# EAGLE design Motores+Bluetoothv4 (EAGLE 7.1.0)
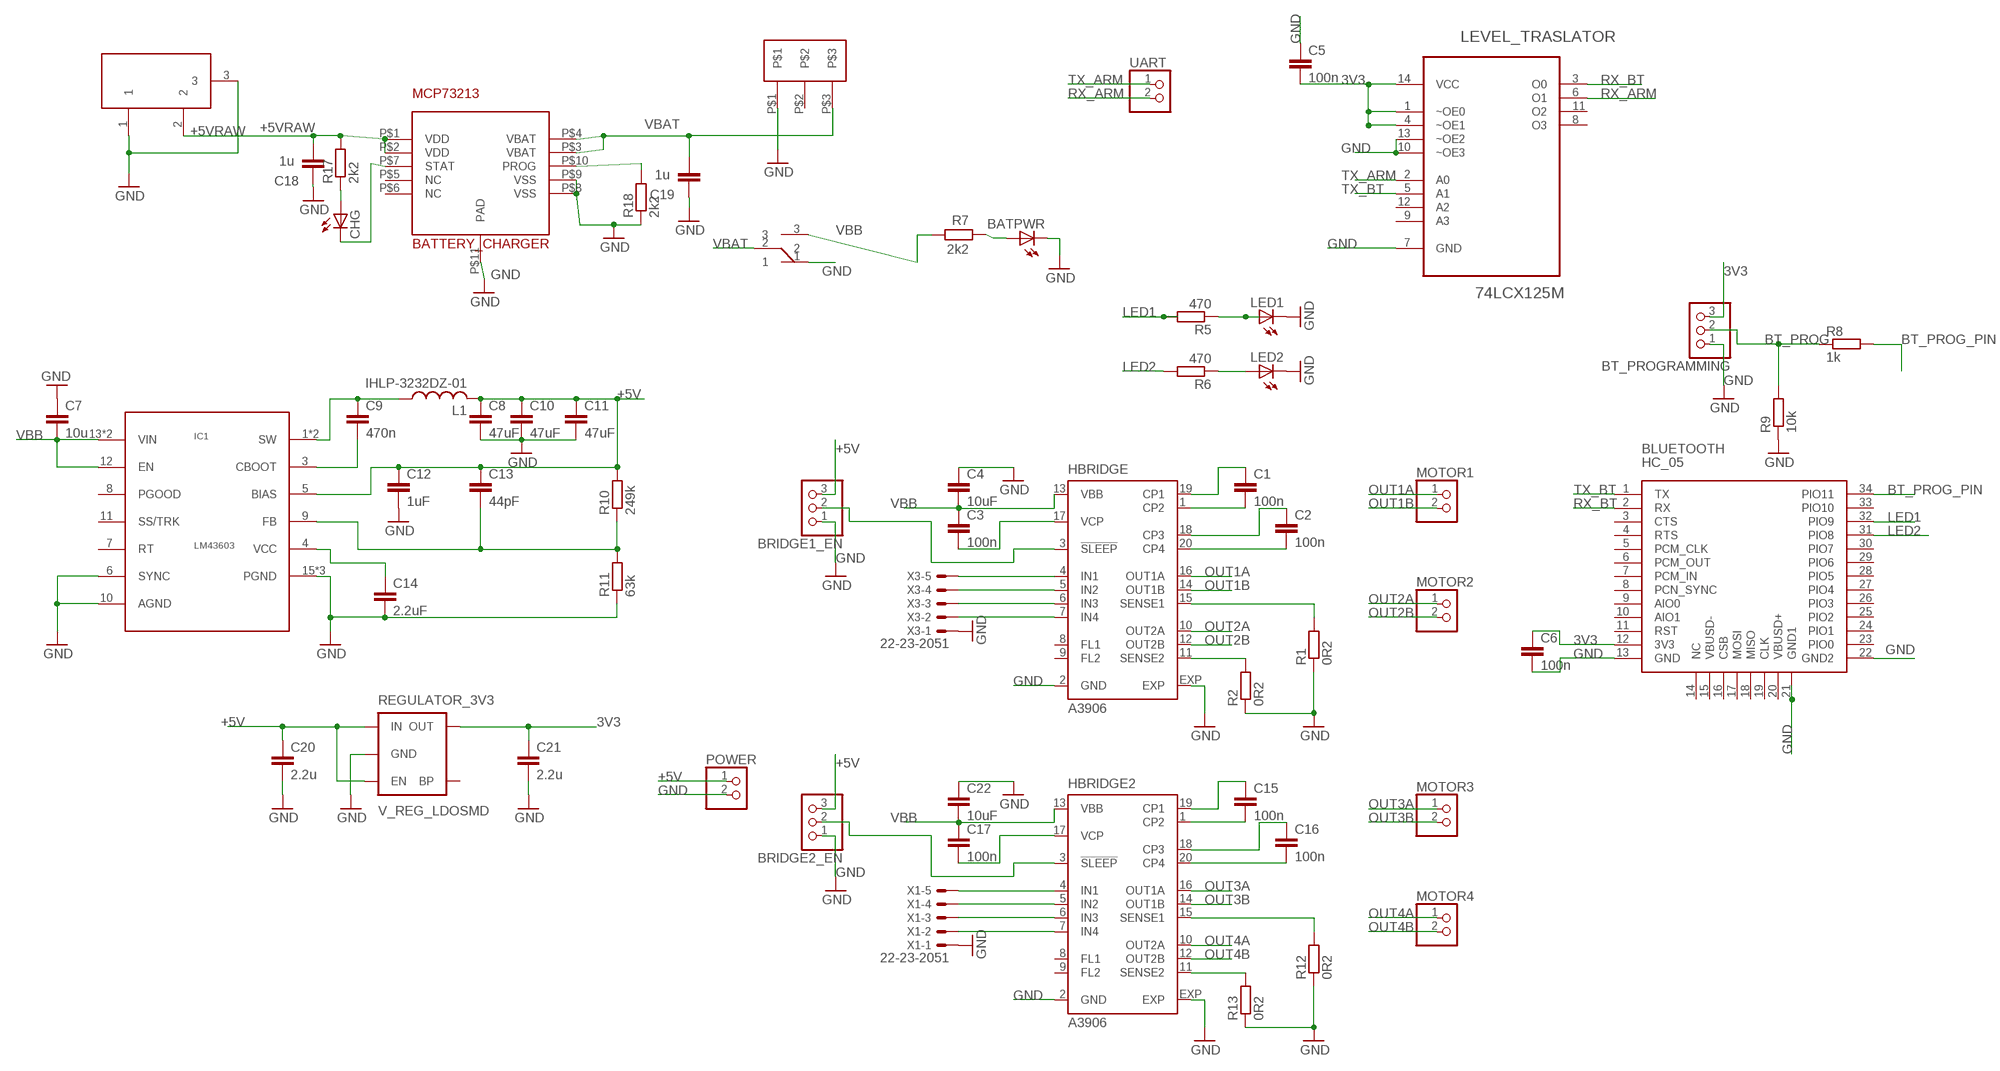
[diagram p0: schematic, sheet 1]

## Parts
BATPWR  LEDCHIPLED_0603  [CHIPLED_0603]
BATTERY_CHARGER  MCP73213  [DFN103X3]
BLUETOOTH  HC_05  [BLUETOOTH_SMD]
BRIDGE1_EN  PINHD-1X3ROUND  [1X03ROUND]
BRIDGE2_EN  PINHD-1X3ROUND  [1X03ROUND]
BT_PROGRAMMING  PINHD-1X3ROUND  [1X03ROUND]
C1  100n  C-EUC0603  [C0603]
C2  100n  C-EUC0603  [C0603]
C3  100n  C-EUC0603  [C0603]
C4  10uF  C-EUC0805  [C0805]
C5  100n  C-EUC0603  [C0603]
C6  100n  C-EUC0603  [C0603]
C7  10u  C-EUC1206  [C1206]
C8  47uF  C-EUC1210  [C1210]
C9  470n  C-EUC0603  [C0603]
C10  47uF  C-EUC1210  [C1210]
C11  47uF  C-EUC1210  [C1210]
C12  1uF  C-EUC0805  [C0805]
C13  44pF  C-EUC0603  [C0603]
C14  2.2uF  C-EUC0805  [C0805]
C15  100n  C-EUC0603  [C0603]
C16  100n  C-EUC0603  [C0603]
C17  100n  C-EUC0603  [C0603]
C18  1u  C-EUC0603  [C0603]
C19  1u  C-EUC0603  [C0603]
C20  2.2u  C-EUC0603K  [C0603K]
C21  2.2u  C-EUC0603K  [C0603K]
C22  10uF  C-EUC0805  [C0805]
CHG  LEDCHIPLED_0603  [CHIPLED_0603]
HBRIDGE  A3906  [QFN20]
HBRIDGE2  A3906  [QFN20]
IC1  LM43603  [PW_R-PDSO-G16]
L1  IHLP-3232DZ-01  [IHLP-3232DZ-01]
LED1  LEDCHIP-LED0603  [CHIP-LED0603]
LED2  LEDCHIP-LED0603  [CHIP-LED0603]
LEVEL_TRASLATOR  74LCX125M  [SOIC127P600X175-14N]
MOTOR1  PINHD-1X2ROUND  [1X02ROUND]
MOTOR2  PINHD-1X2ROUND  [1X02ROUND]
MOTOR3  PINHD-1X2ROUND  [1X02ROUND]
MOTOR4  PINHD-1X2ROUND  [1X02ROUND]
POWER  PINHD-1X2ROUND  [1X02ROUND]
R1  0R2  R-EU_R0805  [R0805]
R2  0R2  R-EU_R0805  [R0805]
R5  470  R-EU_R0603  [R0603]
R6  470  R-EU_R0603  [R0603]
R7  2k2  R-EU_R0603  [R0603]
R8  1k  R-EU_R0603  [R0603]
R9  10k  R-EU_R0603  [R0603]
R10  249k  R-EU_R0603  [R0603]
R11  63k  R-EU_R0603  [R0603]
R12  0R2  R-EU_R0805  [R0805]
R13  0R2  R-EU_R0805  [R0805]
R17  2k2  R-EU_R0603  [R0603]
R18  2k2  R-EU_R0603  [R0603]
REGULATOR_3V3  V_REG_LDOSMD  [SOT23-5]
U$1  100SP1T1B4M2QE  [100SP1T1B4M2QE]
U$3  JST-XHA-3  [JST-XHA-3]
UART  PINHD-1X2ROUND  [1X02ROUND]
X1  22-23-2051  [22-23-2051]
X2  DC21MMX  [DC-21MM]
X3  22-23-2051  [22-23-2051]

## Nets
3V3: BLUETOOTH.12(3V3) BT_PROGRAMMING.3 C5.2 C6.1 C21.1 LEVEL_TRASLATOR.1(~OE0) LEVEL_TRASLATOR.4(~OE1) LEVEL_TRASLATOR.14(VCC) REGULATOR_3V3.5(OUT)
+5V: BRIDGE1_EN.3 BRIDGE2_EN.3 C8.1 C10.1 C11.1 C12.1 C13.1 C20.1 IC1.5(BIAS) L1.P$2 POWER.1 R10.2 REGULATOR_3V3.1(IN) REGULATOR_3V3.3(EN)
+5VRAW: BATTERY_CHARGER.P$1(VDD) BATTERY_CHARGER.P$2(VDD) C18.1 R17.2 X2.2
BT_PROG: BT_PROGRAMMING.2 R8.1 R9.2
BT_PROG_PIN: BLUETOOTH.34(PIO11) R8.2
GND: BATPWR.C BATTERY_CHARGER.P$8(VSS) BATTERY_CHARGER.P$9(VSS) BATTERY_CHARGER.P$11(PAD) BLUETOOTH.13(GND) BLUETOOTH.21(GND1) BLUETOOTH.22(GND2) BRIDGE1_EN.1 BRIDGE2_EN.1 BT_PROGRAMMING.1 C4.1 C5.1 C6.2 C7.1 C8.2 C10.2 C11.2 C12.2 C14.2 C18.2 C19.2 C20.2 C21.2 C22.1 HBRIDGE2.2(GND) HBRIDGE2.EXP HBRIDGE.2(GND) HBRIDGE.EXP IC1.6(SYNC) IC1.10(AGND) IC1.15(PGND) IC1.16(PGND) IC1.TP(PGND) LED1.C LED2.C LEVEL_TRASLATOR.7(GND) LEVEL_TRASLATOR.10(~OE3) LEVEL_TRASLATOR.13(~OE2) POWER.2 R1.1 R2.1 R9.1 R11.1 R12.1 R13.1 R18.1 REGULATOR_3V3.2(GND) U$1.1 U$3.P$1 X1.1 X2.1 X2.3 X3.1
LED1: BLUETOOTH.32(PIO9) R5.2
LED2: BLUETOOTH.31(PIO8) R6.2
N$1: C1.1 HBRIDGE.19(CP1)
N$2: C1.2 HBRIDGE.1(CP2)
N$3: C2.1 HBRIDGE.18(CP3)
N$4: C2.2 HBRIDGE.20(CP4)
N$5: C3.2 HBRIDGE.17(VCP)
N$6: LED2.A R6.1
N$7: HBRIDGE.15(SENSE1) R1.2
N$8: HBRIDGE.11(SENSE2) R2.2
N$9: HBRIDGE.4(IN1) X3.5
N$10: HBRIDGE.5(IN2) X3.4
N$11: HBRIDGE.6(IN3) X3.3
N$12: HBRIDGE.7(IN4) X3.2
N$13: BRIDGE1_EN.2 HBRIDGE.3(!SLEEP)
N$14: LED1.A R5.1
N$15: BATPWR.A R7.2
N$16: C9.2 IC1.3(CBOOT)
N$17: C9.1 IC1.1(SW) IC1.2(SW) L1.P$1
N$18: C14.1 IC1.4(VCC)
N$19: C13.2 IC1.9(FB) R10.1 R11.2
N$20: C15.1 HBRIDGE2.19(CP1)
N$21: C15.2 HBRIDGE2.1(CP2)
N$22: C16.1 HBRIDGE2.18(CP3)
N$23: C16.2 HBRIDGE2.20(CP4)
N$24: C17.2 HBRIDGE2.17(VCP)
N$25: HBRIDGE2.15(SENSE1) R12.2
N$26: HBRIDGE2.11(SENSE2) R13.2
N$27: HBRIDGE2.4(IN1) X1.5
N$28: HBRIDGE2.5(IN2) X1.4
N$29: HBRIDGE2.6(IN3) X1.3
N$30: HBRIDGE2.7(IN4) X1.2
N$31: BRIDGE2_EN.2 HBRIDGE2.3(!SLEEP)
N$43: CHG.A R17.1
N$44: BATTERY_CHARGER.P$7(STAT) CHG.C
N$45: BATTERY_CHARGER.P$10(PROG) R18.2
OUT1A: HBRIDGE.16(OUT1A) MOTOR1.1
OUT1B: HBRIDGE.14(OUT1B) MOTOR1.2
OUT2A: HBRIDGE.10(OUT2A) MOTOR2.1
OUT2B: HBRIDGE.12(OUT2B) MOTOR2.2
OUT3A: HBRIDGE2.16(OUT1A) MOTOR3.1
OUT3B: HBRIDGE2.14(OUT1B) MOTOR3.2
OUT4A: HBRIDGE2.10(OUT2A) MOTOR4.1
OUT4B: HBRIDGE2.12(OUT2B) MOTOR4.2
RX_ARM: LEVEL_TRASLATOR.6(O1) UART.2
RX_BT: BLUETOOTH.2(RX) LEVEL_TRASLATOR.3(O0)
TX_ARM: LEVEL_TRASLATOR.2(A0) UART.1
TX_BT: BLUETOOTH.1(TX) LEVEL_TRASLATOR.5(A1)
VBAT: BATTERY_CHARGER.P$3(VBAT) BATTERY_CHARGER.P$4(VBAT) C19.1 U$1.2 U$3.P$3
VBB: C3.1 C4.2 C7.2 C17.1 C22.2 HBRIDGE2.13(VBB) HBRIDGE.13(VBB) IC1.12(EN) IC1.13(VIN) IC1.14(VIN) R7.1 U$1.3
Unconnected: BATTERY_CHARGER.P$5(NC) BATTERY_CHARGER.P$6(NC) BLUETOOTH.3(CTS) BLUETOOTH.4(RTS) BLUETOOTH.5(PCM_CLK) BLUETOOTH.6(PCM_OUT) BLUETOOTH.7(PCM_IN) BLUETOOTH.8(PCN_SYNC) BLUETOOTH.9(AIO0) BLUETOOTH.10(AIO1) BLUETOOTH.11(RST) BLUETOOTH.14(NC) BLUETOOTH.15(VBUSD-) BLUETOOTH.16(CSB) BLUETOOTH.17(MOSI) BLUETOOTH.18(MISO) BLUETOOTH.19(CLK) BLUETOOTH.20(VBUSD+) BLUETOOTH.23(PIO0) BLUETOOTH.24(PIO1) BLUETOOTH.25(PIO2) BLUETOOTH.26(PIO3) BLUETOOTH.27(PIO4) BLUETOOTH.28(PIO5) BLUETOOTH.29(PIO6) BLUETOOTH.30(PIO7) BLUETOOTH.33(PIO10) HBRIDGE2.8(FL1) HBRIDGE2.9(FL2) HBRIDGE.8(FL1) HBRIDGE.9(FL2) IC1.7(RT) IC1.8(PGOOD) IC1.11(SS/TRK) LEVEL_TRASLATOR.8(O3) LEVEL_TRASLATOR.9(A3) LEVEL_TRASLATOR.11(O2) LEVEL_TRASLATOR.12(A2) REGULATOR_3V3.4(BP) U$3.P$2

## Library data of the parts
BATPWR CHG LED1 LED2 = led:LED: LED OSRAM: - CHIPLED LG R971, LG N971, LY N971, LG Q971, LY Q971, LO R971, LY R971 LH N974, LH R974 LS Q976, LO Q976, LY Q976 LO Q996 - Hyper CHIPLED LW Q18S LB Q993, LB Q99A, LB R99A - SideLED LS A670, LO A670, LY A670, LG A670, LP A670 LB A673, LV A673, LT A673, LW A673 LH A674 LY A675 LS A676, LA A676, LO A676, LY A676, LW A676 LS A679, LY A679, LG A679 - Hyper Micro SIDELED® LS Y876, LA Y876, LO Y876, LY Y876 LT Y87S - SmartLED LW L88C, LW L88S LB L89C, LB L89S, LG L890 LS L89K, LO L89K, LY L89K LS L896, LA L896, LO L896, LY L896 - TOPLED LS T670, LO T670, LY T670, LG T670, LP T670 LSG T670, LSP T670, LSY T670, LOP T670, LYG T670 LG T671, LOG T671, LSG T671 LB T673, LV T673, LT T673, LW T673 LH T674 LS T676, LA T676, LO T676, LY T676, LB T676, LH T676, LSB T676, LW T676 LB T67C, LV T67C, LT T67C, LS T67K, LO T67K, LY T67K, LW E67C LS E67B, LA E67B, LO E67B, LY E67B, LB E67C, LV E67C, LT E67C LW T67C LS T679, LY T679, LG T679 LS T770, LO T770, LY T770, LG T770, LP T770 LB T773, LV T773, LT T773, LW T773 LH T774 LS E675, LA E675, LY E675, LS T675 LS T776, LA T776, LO T776, LY T776, LB T776 LHGB T686 LT T68C, LB T68C - Hyper Mini TOPLED® LB M676 - Mini TOPLED Santana® LG M470 LS M47K, LO M47K, LY M47K Source: http://www.osram.convergy.de LUXEON: - LUMILED® LXK2-PW12-R00, LXK2-PW12-S00, LXK2-PW14-U00, LXK2-PW14-V00 LXK2-PM12-R00, LXK2-PM12-S00, LXK2-PM14-U00 LXK2-PE12-Q00, LXK2-PE12-R00, LXK2-PE12-S00, LXK2-PE14-T00, LXK2-PE14-U00 LXK2-PB12-K00, LXK2-PB12-L00, LXK2-PB12-M00, LXK2-PB14-N00, LXK2-PB14-P00, LXK2-PB14-Q00 LXK2-PR12-L00, LXK2-PR12-M00, LXK2-PR14-Q00, LXK2-PR14-R00 LXK2-PD12-Q00, LXK2-PD12-R00, LXK2-PD12-S00 LXK2-PH12-R00, LXK2-PH12-S00 LXK2-PL12-P00, LXK2-PL12-Q00, LXK2-PL12-R00 Source: www.luxeon.com KINGBRIGHT: KA-3528ASYC Source: www.kingbright.com
BATTERY_CHARGER = TEORA:MCP73213
BLUETOOTH = Bluetooth%20HC-05:HC_05: HC-05 Bluetooth Module
BRIDGE1_EN BRIDGE2_EN BT_PROGRAMMING = pinhead:PINHD-1X3: PIN HEADER
C1-C22 = rcl:C-EU: CAPACITOR, European symbol
HBRIDGE HBRIDGE2 = allegro:A3906: Low Voltage Stepper and Single/Dual DC Motor Driver Data Sheet <http://www.allegromicro.com/en/Products/Part_Numbers/3906/3906.pdf>
IC1 = texas2:LM43603
L1 = ArmDuino:IHLP-3232DZ-01
LEVEL_TRASLATOR = 74LCX125:74LCX125M: Low Voltage Quad Buffer with 5V Tolerant Inputs and Outputs; MPN: 74LCX125M; OC_FARNELL: 1013776; OC_NEWARK: 78K6286; PACKAGE: SOIC-14; SUPPLIER: Fairchild
MOTOR1-MOTOR4 POWER UART = pinhead:PINHD-1X2: PIN HEADER
R1 R2 R5-R13 R17 R18 = rcl:R-EU_: RESISTOR, European symbol
REGULATOR_3V3 = SparkFun:V_REG_LDO: Voltage Regulator LDO Standard 150mA LDO voltage regulator in SOT-23 layout. Micrel part MIC5205. BP (by-pass) pin is used to lower output noise with 470pF cap.
U$1 = switch:100SP1T1B4M2QE
U$3 = TEORA:JST-XHA-3
X1 X3 = con-molex:22-23-2051: .100" (2.54mm) Center Header - 5 Pin; MF: MOLEX; MPN: 22-23-2051; OC_FARNELL: 1462952; OC_NEWARK: 38C9178
X2 = powersupply:DC21MM

## Board
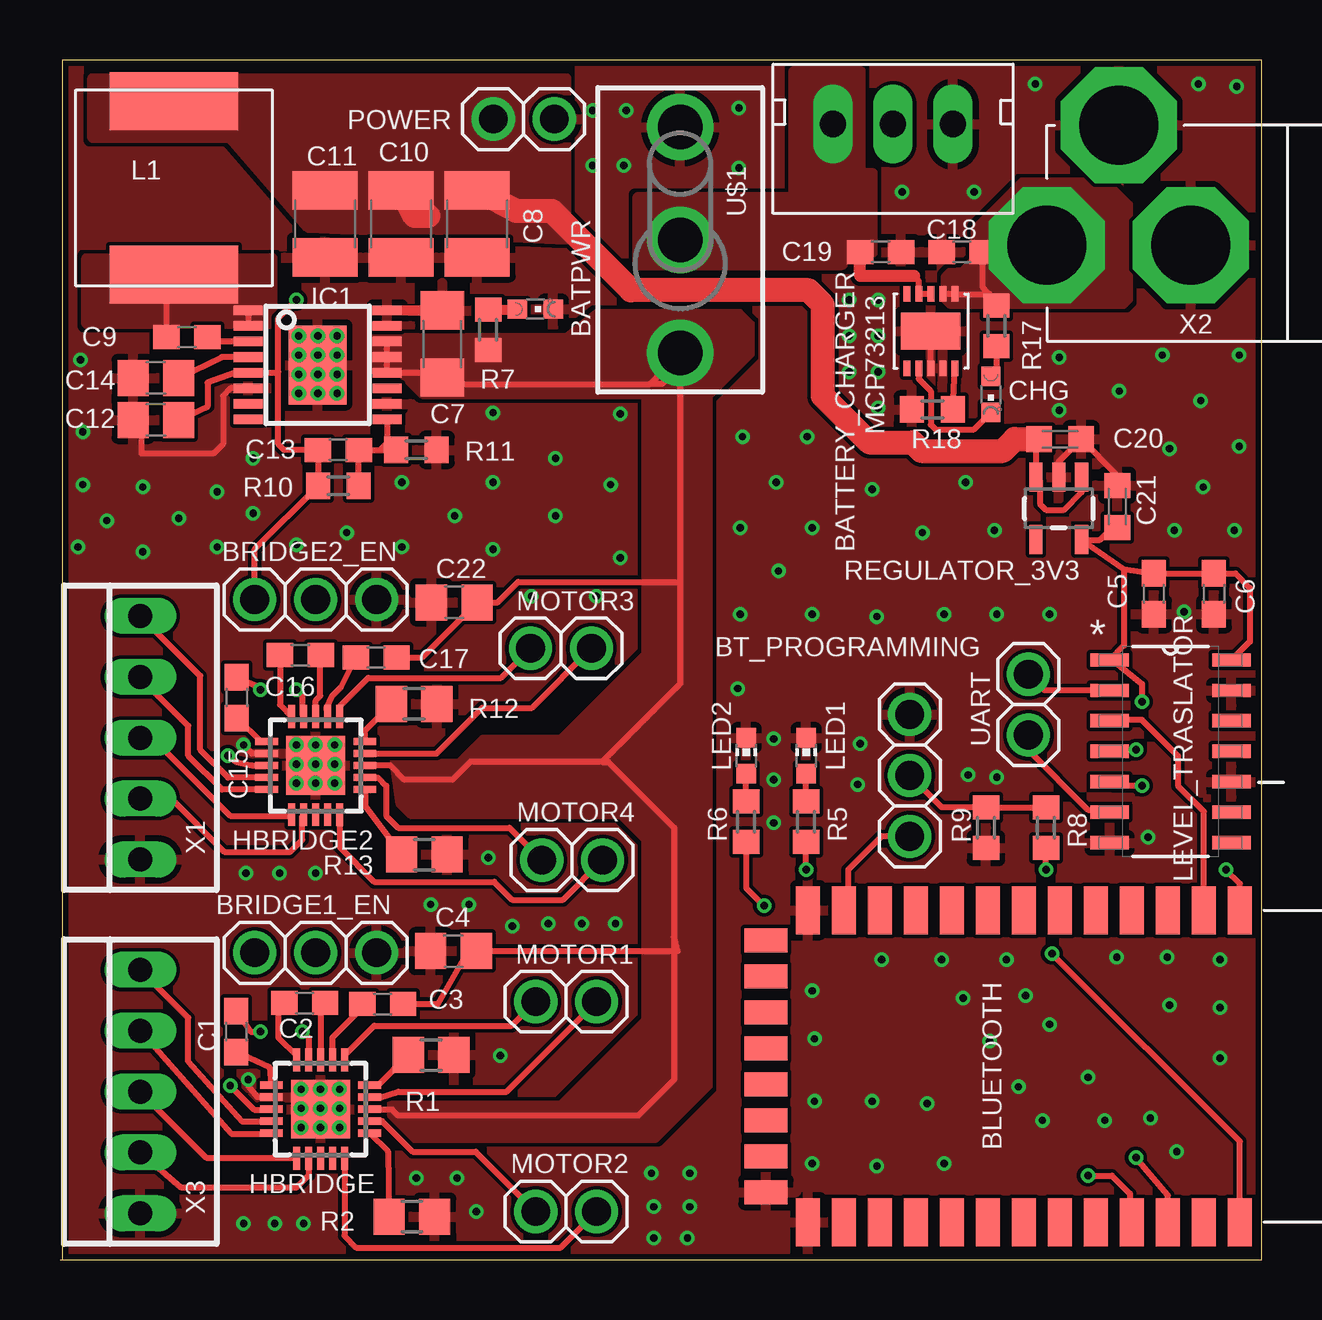
[diagram p1: board, top side]
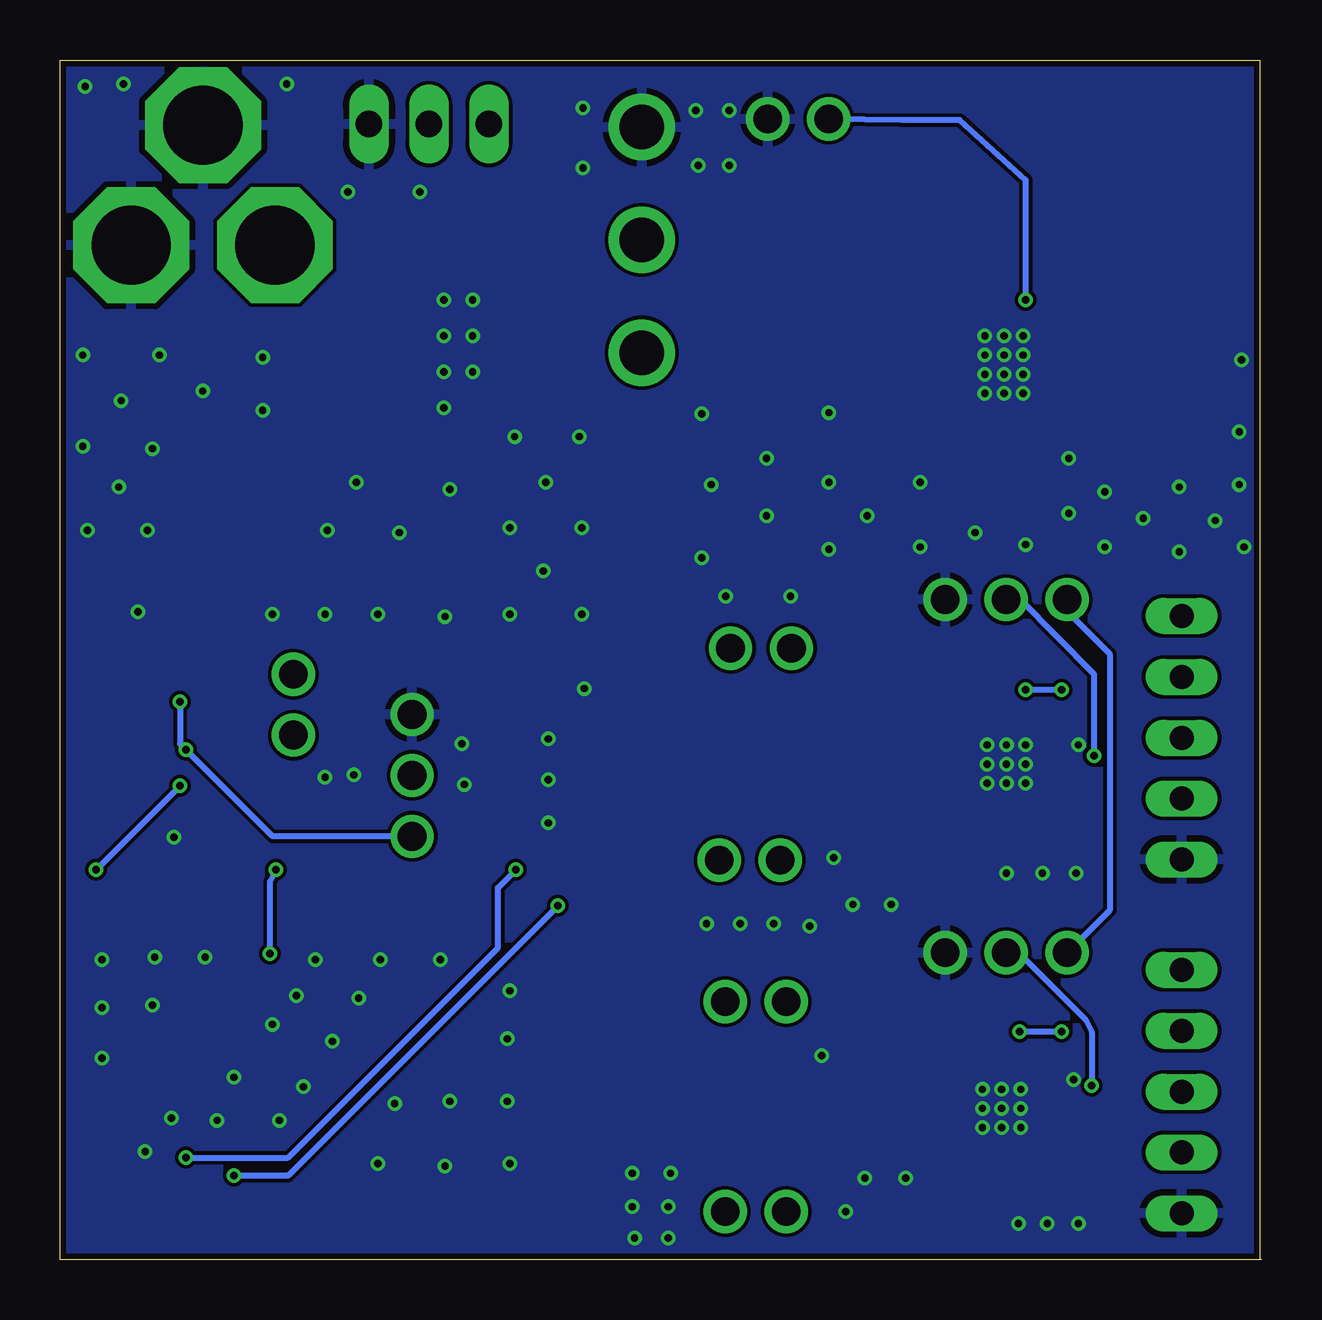
[diagram p2: board, bottom side, seen from below]

Size 50.1 x 50 mm. Coordinates in mm from the lower left corner, seen from the top.
Outline: 0.1,0 0.1,50 50.1,50 50.1,0 0.1,0
Outline: 0,0 0.1,0
Copper layers (1*16): Top 0.035mm / dielectric 1.5mm / Bottom 0.035mm
Design rules "Elecrow_2-layer_eagle_rule *": minimum track width 6mil, minimum drill 3mil, track to track 6mil, track to pad 6mil, pad to pad 6mil, via to via 6mil, smd to smd 0mil, copper to edge 10mil, drill to drill 10mil, minimum pad ring 10mil, minimum via ring 6mil, stop-mask expansion 2mil, vias tented up to drill 100mil, thermal gap 10mil

### Footprints (pad centres in the part's own frame; a part is rotated, then mirrored left to right if it is on the bottom)
CHIPLED_0603 = smd 0.8 x 0.8: A 0,-0.75; C 0,0.75
DFN103X3 = smd 0.65 x 0.3: P$1 -1.55,1; P$2 -1.55,0.5; P$3 -1.55,0; P$4 -1.55,-0.5; P$5 -1.55,-1; P$6 1.55,-1; P$7 1.55,-0.5; P$8 1.55,0; P$9 1.55,0.5; P$10 1.55,1 | smd 1.55 x 2.48: P$11 0,0
BLUETOOTH_SMD = smd 2 x 1: 1 -6.35,3.81; 2 -6.35,2.31; 3 -6.35,0.81; 4 -6.35,-0.69; 5 -6.35,-2.19; 6 -6.35,-3.69; 7 -6.35,-5.19; 8 -6.35,-6.69; 9 -6.35,-8.19; 10 -6.35,-9.69; 11 -6.35,-11.19; 12 -6.35,-12.69; 13 -6.35,-14.19; 22 6.65,-14.19; 23 6.65,-12.69; 24 6.65,-11.19; 25 6.65,-9.69; 26 6.65,-8.19; 27 6.65,-6.69; 28 6.65,-5.19; 29 6.65,-3.69; 30 6.65,-2.19; 31 6.65,-0.69; 32 6.65,0.81; 33 6.65,2.31; 34 6.65,3.81 | smd 1 x 1.8: 14 -5.1,-15.94; 15 -3.6,-15.94; 16 -2.1,-15.94; 17 -0.6,-15.94; 18 0.9,-15.94; 19 2.4,-15.94; 20 3.9,-15.94; 21 5.4,-15.94
1X03ROUND = drill 1.2: 1 -2.54,0; 2 0,0; 3 2.54,0
C0603 = smd 1.1 x 1: 1 -0.85,0; 2 0.85,0
C0805 = smd 1.3 x 1.5: 1 -0.95,0; 2 0.95,0
C1206 = smd 1.6 x 1.8: 1 -1.4,0; 2 1.4,0
C1210 = smd 1.6 x 2.7: 1 -1.4,0; 2 1.4,0
C0603K = smd 1.05 x 1.08: 1 -0.875,0; 2 0.875,0
QFN20 = smd 0.95 x 0.3: 1 -2.05,1; 2 -2.05,0.5; 3 -2.05,0; 4 -2.05,-0.5; 5 -2.05,-1; 11 2.05,-1; 12 2.05,-0.5; 13 2.05,0; 14 2.05,0.5; 15 2.05,1 | smd 0.3 x 0.95: 6 -1,-2.05; 7 -0.5,-2.05; 8 0,-2.05; 9 0.5,-2.05; 10 1,-2.05; 16 1,2.05; 17 0.5,2.05; 18 0,2.05; 19 -0.5,2.05; 20 -1,2.05 | smd 2.45 x 2.45: EXP 0,0
PW_R-PDSO-G16 = smd 0.4 x 1.2: 1 -2.275,-2.9; 2 -1.625,-2.9; 3 -0.975,-2.9; 4 -0.325,-2.9; 5 0.325,-2.9; 6 0.975,-2.9; 7 1.625,-2.9; 8 2.275,-2.9; 9 2.275,2.9; 10 1.625,2.9; 11 0.975,2.9; 12 0.325,2.9; 13 -0.325,2.9; 14 -0.975,2.9; 15 -1.625,2.9; 16 -2.275,2.9 | smd 3.29 x 2.41: TP 0,0
IHLP-3232DZ-01 = smd 2.413 x 5.334: P$1 3.619,0; P$2 -3.619,0
CHIP-LED0603 = smd 0.8 x 0.8: A 0,-0.75; C 0,0.75
SOIC127P600X175-14N = smd 1.6 x 0.559: 1 -2.54,3.81; 2 -2.54,2.54; 3 -2.54,1.27; 4 -2.54,0; 5 -2.54,-1.27; 6 -2.54,-2.54; 7 -2.54,-3.81; 8 2.54,-3.81; 9 2.54,-2.54; 10 2.54,-1.27; 11 2.54,0; 12 2.54,1.27; 13 2.54,2.54; 14 2.54,3.81
1X02ROUND = drill 1.2: 1 -1.27,0; 2 1.27,0
R0805 = smd 1.3 x 1.5: 1 -0.95,0; 2 0.95,0
R0603 = smd 1 x 1.1: 1 -0.85,0; 2 0.85,0
SOT23-5 = smd 0.55 x 1.2: 1 -0.95,-1.3; 2 0,-1.3; 3 0.95,-1.3; 4 0.95,1.3; 5 -0.95,1.3
100SP1T1B4M2QE = drill 1.85: 1 -4.7,0; 2 0,0; 3 4.7,0
JST-XHA-3 = drill 1.1 long: P$1 -2.5,0; P$2 0,0; P$3 2.5,0
22-23-2051 = drill 1 long: 1 -5.08,0; 2 -2.54,0; 3 0,0; 4 2.54,0; 5 5.08,0
DC-21MM = drill 3.302 pad 4.826 octagon: 1 -5.08,-3.353; 2 -0.076,-6.35; 3 -0.076,-0.356

### Placement (x,y rotation side)
BATPWR  19.81,39.61 270 top
BATTERY_CHARGER  36.3,38.7 270 top
BLUETOOTH  45.37,8.21 270 top
BRIDGE1_EN  10.66,12.79 180 top
BRIDGE2_EN  10.66,27.51 180 top
BT_PROGRAMMING  35.42,20.18 270 top
C1  7.35,9.5 270 top
C2  10.2,10.69 180 top
C3  13.45,10.65 180 top
C4  16.4,12.86 0 top
C5  45.6,27.75 90 top
C6  48.1,27.75 270 top
C7  15.94,38.16 270 top
C8  17.39,43.17 270 top
C9  5.29,38.44 0 top
C10  14.22,43.17 270 top
C11  11.05,43.17 270 top
C12  4,35 180 top
C13  11.6,33.75 0 top
C14  4,36.75 180 top
C15  7.37,23.42 270 top
C16  10.02,25.19 180 top
C17  13.18,25.1 180 top
C18  37.6,42 180 top
C19  34.21,41.99 0 top
C20  41.69,34.19 0 top
C21  44.07,31.39 90 top
C22  16.43,27.39 0 top
CHG  38.8,36.06 180 top
HBRIDGE  10.86,6.27 0 top
HBRIDGE2  10.66,20.59 0 top
IC1  10.74,37.29 270 top
L1  4.75,44.67 270 top
LED1  31.1,21 0 top
LED2  28.6,21 0 top
LEVEL_TRASLATOR  46.29,21.18 0 top
MOTOR1  21.1,10.75 0 top
MOTOR2  21.1,2 180 top
MOTOR3  20.88,25.48 0 top
MOTOR4  21.35,16.65 180 top
POWER  19.33,47.54 0 top
R1  15.47,8.53 180 top
R2  14.67,1.79 180 top
R3  [R0603]  65.77,37.76 0 top  (outside the outline)
R4  NM  [R0603]  60.77,35.95 0 top  (outside the outline)
R5  31.1,18.25 270 top
R6  28.6,18.25 270 top
R7  17.85,38.75 90 top
R8  41.1,18 270 top
R9  38.6,18 90 top
R10  11.6,32.25 180 top
R11  14.85,33.75 180 top
R12  14.76,23.16 180 top
R13  15.19,16.88 180 top
R17  39.03,38.92 90 top
R18  36.36,35.43 0 top
REGULATOR_3V3  41.63,31.31 180 top
U$1  25.85,42.5 270 top
U$3  34.72,47.33 180 top
UART  40.37,23.13 270 top
X1  3.35,21.75 90 top
X2  47.49,42.2 270 top
X3  3.35,7 90 top

### Tracks (layer width: path | path; a pad name or v marks a point on that pad's centre or on a via)
3V3  (via drill 0.3)
  Top 0.25: C21.1 43.87,30.52 43.35,30 REGULATOR_3V3.5 44.35,28.78 | 44.35,28.78 C5.2 C6.1 49,28.6 49.6,28 49.6,25.76 LEVEL_TRASLATOR.14 | 44.35,28.78 44.35,25.59 LEVEL_TRASLATOR.1 43.86,24.99 45.1,24 v45.1,23.25 | v44.85,21.25 43.82,21.25 LEVEL_TRASLATOR.4 | BT_PROGRAMMING.3 34.24,17.64 32.85,16.25 32.85,14.73 BLUETOOTH.12
  Bottom 0.25: v45.1,23.25 45.1,21.5 v44.85,21.25 41.24,17.64 BT_PROGRAMMING.3
+5V  (via drill 0.3)
  Top 0.25: C20.1 40.68,34.05 REGULATOR_3V3.3 40.85,32.44 40.85,31.5 41.1,31.25 41.85,31.25 42.58,31.98 REGULATOR_3V3.1 | C12.1 6.15,35.55 6.15,36.55 7.31,36.97 IC1.5 9.06,36.97 9.1,37 | 9.1,37 9.1,34 9.35,33.75 C13.1 R10.2 8.12,29.62 BRIDGE2_EN.3 | 9.1,37 9.1,39.25 v9.85,40
  Top 1: C8.1 19.02,43.7 20.5,43.7 23.8,40.4 31.2,40.4 31.8,39.8 31.8,36 33.75,34.05 35.55,34.05 35.9,33.7 39.3,33.7 39.8,34.2 40.8,34.2 C20.1 | C10.1 15.28,43.57 15.35,43.5 14.79,43.5 C10.1
  Bottom 0.25: v9.85,40 9.85,45 12.6,47.5 15.02,47.5 POWER.1 | BRIDGE2_EN.3 8.12,27.02 6.35,25.25 6.35,14.56 BRIDGE1_EN.3
  pour Top (rank 2, no thermals): 21.1,42.5 10.35,43 7.1,46.75 1.35,46.75 1.35,49.25 21.1,49.25
+5VRAW
  Top 0.25: BATTERY_CHARGER.P$2 BATTERY_CHARGER.P$1 38.75,40.25 R17.2 38.45,40.55 C18.1 41.6,42 41.85,42.25 41.6,42.25 41.63,42.28 X2.2
  pour Top (no thermals): 44.35,39.75 37.1,39.75 36.85,40 36.85,41 37.1,41.25 37.6,41.25 38.1,41.75 38.1,43 40.1,45 43.6,45 44.6,44 44.6,40
BT_PROG
  Top 0.25: BT_PROGRAMMING.2 36.75,18.85 R9.2 R8.1
BT_PROG_PIN  (via drill 0.3)
  Top 0.25: BLUETOOTH.34 49.18,4.92 v41.35,12.75 | v41.1,16.25 R8.2
  Bottom 0.25: v41.35,12.75 41.35,15.75 v41.1,16.25
GND  (via drill 0.3)
  Top 0.25: C21.2 44.07,32.69 C20.2 41.63,33.26 REGULATOR_3V3.2 | HBRIDGE.2 8.23,6.77 7.85,7.25 v7.85,7.5 | BATTERY_CHARGER.P$8 BATTERY_CHARGER.P$11 | IC1.6 7.11,36.31 6.8,36 6.8,34 6.4,33.6 3.4,33.6 3.4,34.65 C12.2 | HBRIDGE2.2 8.01,21.09 v7.65,21.45
  Top 0.406: IC1.16 C7.1
  other vias: 23.35,35.25 23.35,29.25 17.85,16.75 17.35,2 18.35,8.5 46.85,27 35.1,44.5 38.1,44.5 32.9,40 34.1,40 32.9,38.5 34.1,38.5 32.9,37 34.1,37 34.1,35.5 19.65,27.65 22.35,27.65 7.65,1.5 8.95,1.5 10.15,1.5 14.85,3.4 16.55,3.4 18.85,13.9 20.35,14 21.75,14 23.15,14 15.45,14.8 17.05,14.8 7.75,16.1 9.15,16.1 10.65,16.1 24.65,3.6 26.25,3.6 24.75,2.2 26.25,2.2 24.75,0.9 26.15,0.9 31.35,4 31.45,6.6 31.45,9.2 31.35,11.2 34.25,12.5 36.75,12.5 39.45,12.5 44.05,12.6 46.15,12.6 48.35,12.5 48.35,10.5 48.35,8.4 46.25,10.6 37.65,10.9 40.25,11 41.25,9.8 38.75,9.1 33.85,6.6 34.05,3.9 36.85,4 36.15,6.5 39.95,7.2 42.85,7.6 40.95,5.8 43.55,5.8 45.45,5.9 46.55,4.5 28.25,23.8 29.75,21.7 29.75,20 29.75,18.2 33.35,21.5 33.25,19.8 37.85,20.2 39.05,20.1 45.35,17.6 41.25,26.9 39.05,26.9 36.85,26.9 34.05,26.8 31.35,26.9 28.35,26.9 29.95,28.7 28.35,30.5 31.35,30.5 29.85,32.4 28.45,34.3 31.15,34.3 33.85,32.1 35.95,30.3 37.75,32.4 38.95,30.4 46.45,30.4 48.95,30.4 46.25,33.8 49.15,33.9 47.55,35.8 45.95,37.7 49.15,37.7 44.15,36.2 41.65,37.6 41.65,35.4 20.65,33.4 20.65,31 22.95,32.3 18.05,35.3 18.05,32.4 18.05,29.6 16.45,31 14.25,32.4 14.25,29.7 11.95,30.3 9.85,29.8 8.05,33.4 8.05,31.1 6.55,29.7 6.55,32 4.95,30.9 3.45,32.2 3.45,29.5 1.95,30.8 0.95,32.3 0.75,29.7 0.95,34.5 10.05,7.1 11.65,7.1 10.05,5.5 11.65,5.5 10.05,6.3 10.85,7.1 10.85,6.3 10.85,5.5 11.65,6.3 0.85,37.5 47.65,32.2 9.85,21.45 9.85,20.65 9.85,19.85 10.65,20.65 10.65,21.45 11.45,21.45 11.45,20.65 11.45,19.85 10.65,19.85 9.95,38.5 10.75,38.5 11.55,38.5 11.55,37.7 11.55,36.9 11.55,36.1 10.75,36.1 9.95,36.1 9.95,36.9 9.95,37.7 10.75,37.7 10.75,36.9 49.05,48.9 47.45,49 40.65,49 22.2,45.6 22.2,47.9 23.6,47.9 23.5,45.6 28.3,45.5 28.3,48
  pour Bottom: -1.4,50.75 54.35,50.75 54.35,-1 -1.4,-1
  pour Top (rank 6): -2.4,51.5 55.85,51.5 55.85,-2.25 -2.4,-2.25
LED1  (via drill 0.3)
  Top 0.25: BLUETOOTH.32 46.18,2.67 v44.85,4.25 | v31.1,16.25 R5.2
  Bottom 0.25: v44.85,4.25 40.6,4.25 31.85,13 31.85,15.5 v31.1,16.25
LED2  (via drill 0.3)
  Top 0.25: R6.2 28.6,15.5 v29.35,14.75 | v42.85,3.5 43.85,3.5 44.6,2.75 44.6,1.64 BLUETOOTH.31
  Bottom 0.25: v29.35,14.75 40.6,3.5 v42.85,3.5
N$1  (via drill 0.3)
  Top 0.25: C1.1 7.95,9.5 v8.35,9.5 | v10.1,9.5 10.36,9.24 HBRIDGE.19
  Bottom 0.25: v8.35,9.5 v10.1,9.5
N$2
  Top 0.25: 8.75,7.33 HBRIDGE.1 8.73,8.02 C1.2
N$3
  Top 0.25: C2.1 10.86,10.5 HBRIDGE.18
N$4
  Top 0.25: C2.2 9.1,10.44 9.1,9.25 9.86,8.49 HBRIDGE.20
N$5
  Top 0.25: HBRIDGE.17 11.36,9.26 12.6,10.5 C3.2
N$6
  Top 0.25: R6.1 LED2.A
N$7
  Top 0.25: HBRIDGE.15 13.26,7.27 R1.2
N$8
  Top 0.25: HBRIDGE.11 13.67,4.51 R2.2
N$9
  Top 0.25: HBRIDGE.4 8.79,5.75 7.6,5.75 5.35,8.25 5.35,10.08 X3.5
N$10
  Top 0.25: HBRIDGE.5 8.79,5.25 7.14,5.25 X3.4
N$11
  Top 0.25: HBRIDGE.6 9.83,4.25 6.1,4.25 X3.3
N$12
  Top 0.25: HBRIDGE.7 10.36,3.51 9.85,3 5.06,3 X3.2
N$13  (via drill 0.3)
  Top 0.25: 8.47,6.27 HBRIDGE.3 8.79,6.25 8.1,6.25 v7.1,7.25
  Bottom 0.25: BRIDGE1_EN.2 10.14,12.79 7.35,10 7.1,9.5 v7.1,7.25
N$14
  Top 0.25: R5.1 LED1.A
N$15
  Top 0.406: R7.2 BATPWR.A
N$16
  Top 0.25: IC1.3 5.94,38.27 C9.2
N$17
  Top 0.25: IC1.1 IC1.2 | C9.1 4.44,40.74 L1.P$1
  pour Top (rank 3, no thermals): 1.1,41.75 8.85,41.75 8.85,39 1.1,39
N$18
  Top 0.25: IC1.4 6.75,37.62 C14.1
N$19
  Top 0.25: 13.35,33.75 C13.2 12.45,33.65 | 13.35,33.75 R11.2 | IC1.9 13.64,34.04 13.35,33.75 | R10.1 12.45,33.65 | 12.45,33.65 12.1,34
N$20  (via drill 0.3)
  Top 0.25: C15.1 8.58,23.77 v8.35,23.75 | v9.85,23.75 10.1,23.5 10.1,22.7 HBRIDGE2.19
  Bottom 0.25: v8.35,23.75 v9.85,23.75
N$21
  Top 0.25: C15.2 8.38,21.57 HBRIDGE2.1
N$22
  Top 0.25: HBRIDGE2.18 10.66,23.31 10.85,23.5 10.85,24.92 C16.1
N$23
  Top 0.25: C16.2 9.17,23.13 HBRIDGE2.20
N$24
  Top 0.25: C17.2 11.7,23.85 11.35,23.5 11.1,22.95 HBRIDGE2.17
N$25
  Top 0.25: HBRIDGE2.15 12.71,22.06 R12.2
N$26
  Top 0.25: HBRIDGE2.11 12.71,18.91 R13.2
N$27
  Top 0.25: HBRIDGE2.4 7.01,20.09 5.85,21.25 5.85,24.33 X1.5
N$28
  Top 0.25: HBRIDGE2.5 6.76,19.59 5.35,21 5.35,22.25 3.6,24 3.6,24.04 X1.4
N$29
  Top 0.25: X1.3 3.85,21.75 7.1,18.5 9.62,18.5 HBRIDGE2.6
N$30
  Top 0.25: X1.2 4.64,19.21 6.85,17 9.6,17 10.1,17.5 10.1,18.48 HBRIDGE2.7
N$31  (via drill 0.3)
  Top 0.25: v7,21 7.35,20.75 8,20.6 HBRIDGE2.3
  Bottom 0.25: BRIDGE2_EN.2 10.06,27.51 7,24.4 v7,21
N$43
  Top 0.25: R17.1 39.03,37.04 CHG.A
N$44
  Top 0.25: BATTERY_CHARGER.P$7 35.8,36.7 36.3,36.2 36.3,34.8 36.5,34.6 38.09,34.6 CHG.C
N$45
  Top 0.25: R18.2 BATTERY_CHARGER.P$10
OUT1A
  Top 0.25: HBRIDGE.16 11.86,8.51 13.1,9.75 18.83,9.75 MOTOR1.1
OUT1B
  Top 0.25: HBRIDGE.14 13.37,6.77 14.1,7 18.62,7 MOTOR1.2
OUT2A
  Top 0.25: HBRIDGE.10 11.86,0.99 12.35,0.5 20.87,0.5 MOTOR2.1
OUT2B
  Top 0.25: HBRIDGE.12 13.43,5.77 14.7,4.5 17.33,4.5 MOTOR2.2
OUT3A
  Top 0.25: HBRIDGE2.16 11.66,23.06 12.85,24.25 18.38,24.25 MOTOR3.1
OUT3B
  Top 0.25: HBRIDGE2.14 15.69,21.09 17.6,23 19.67,23 MOTOR3.2
OUT4A
  Top 0.25: HBRIDGE2.10 11.66,17.19 13.1,15.75 18.1,15.75 18.85,15 20.97,15 MOTOR4.1
OUT4B
  Top 0.25: HBRIDGE2.12 13.26,20.09 13.6,19.75 13.6,18.5 14.1,18 18.73,18 MOTOR4.2
RX_ARM
  Top 0.25: UART.2 40.37,21.23 42.85,18.75 43.64,18.75 LEVEL_TRASLATOR.6
RX_BT
  Top 0.25: BLUETOOTH.2 47.68,18.67 46.6,19.75 46.6,21 45.1,22.5 43.8,22.5 LEVEL_TRASLATOR.3
TX_ARM
  Top 0.25: LEVEL_TRASLATOR.2 41.05,23.72 UART.1
TX_BT  (via drill 0.3)
  Top 0.25: BLUETOOTH.1 49.18,15.67 v48.6,16.25 | v45.1,19.75 43.91,19.75 LEVEL_TRASLATOR.5
  Bottom 0.25: v48.6,16.25 v45.1,19.75
VBAT
  Top 0.25: BATTERY_CHARGER.P$3 BATTERY_CHARGER.P$4 35.8,40.8 35.6,41
  Top 0.5: 35.6,41 33.35,41 C19.1
  pour Top (no thermals): 33.85,42 33.85,45.25 33.35,45.25 33.35,49.5 30.6,49.5 30.6,48 30.6,44.25 24.1,44.25 24.1,41.5 32.6,41.5 32.6,42
VBB
  Top 0.25: IC1.14 IC1.13 IC1.12 15.73,36.97 C7.2 16.2,36.5 24.6,36.5 | 12.94,6.3 HBRIDGE.13 12.93,6.25 13.85,6.25 14.1,6 24.1,6 25.6,7.5 25.6,13.5 | U$1.3 26.56,37.96 25.1,36.5 24.6,36.5 | 24.6,36.5 25.85,37.75 25.85,28.25 | 25.85,28.25 25.85,24 22.6,20.75 | 22.6,20.75 17.1,20.75 16.35,20 14.35,20 13.75,20.6 HBRIDGE2.13 | 22.6,20.75 22.85,20.75 25.6,18 25.6,13.5 | 25.6,13.5 25.74,12.86 C4.2 17.1,13 15.75,10.65 C3.1 | 25.85,28.25 19.1,28.25 18.24,27.39 C22.2 15.09,25.1 C17.1
  pour Top (no thermals): 13.1,38.5 13.1,37 14.1,37 15.1,36 27.1,36 28.85,37.75 28.85,39 28.35,39.5 22.35,39.5 21.1,38.5
  pour Top: 13.6,6.5 13.85,5.75 14.6,5 24.85,5 27.1,7.25 27.1,36.5 24.35,36.5 24.35,25.25 20.85,21.75 17.6,21.75 16.6,20.75 13.85,20.75 14.1,19 14.6,18.5 23.35,18.5 24.35,17.5 24.35,10 20.85,6.5